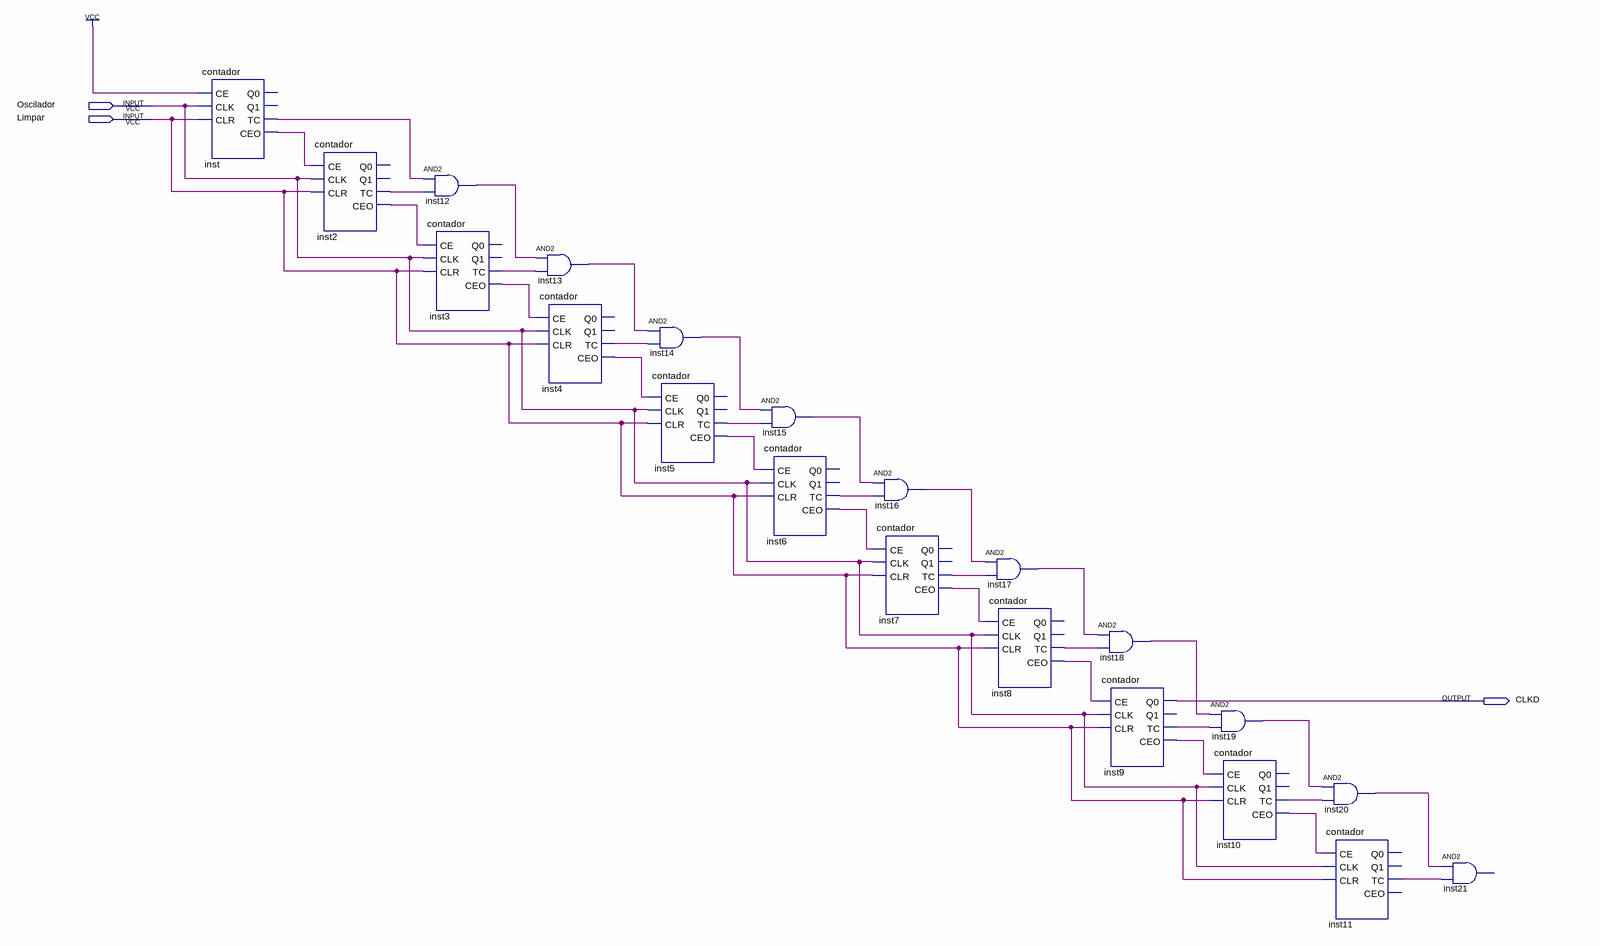
[diagram p0: schematic sheet]
// Quartus schematic divisorDeFrequencia.bdf as structural Verilog: 21 symbols, 3 pins
module divisorDeFrequencia (
  input  Oscilador,
  input  Limpar,
  output CLKD
);

  wire inst2_ceo, inst2_tc, inst3_ceo, inst3_tc, inst4_ceo, inst4_tc, inst5_ceo, inst5_tc, inst6_ceo,
       inst6_tc, inst7_ceo, inst7_tc, inst8_ceo, inst8_tc, inst9_ceo, inst9_tc, inst10_ceo, inst10_tc,
       inst11_tc, inst12_out, inst13_out, inst14_out, inst15_out, inst16_out, inst17_out, inst18_out,
       inst19_out, inst20_out, inst_ceo, inst_tc;

  contador inst (.CE(1'b1), .CLK(Oscilador), .CLR(Limpar), .TC(inst_tc), .CEO(inst_ceo));  // open: Q0, Q1
  contador inst2 (.CE(inst_ceo), .CLK(Oscilador), .CLR(Limpar), .TC(inst2_tc), .CEO(inst2_ceo));  // open: Q0, Q1
  and inst12 (inst12_out, inst_tc, inst2_tc);
  contador inst3 (.CE(inst2_ceo), .CLK(Oscilador), .CLR(Limpar), .TC(inst3_tc), .CEO(inst3_ceo));  // open: Q0, Q1
  and inst13 (inst13_out, inst12_out, inst3_tc);
  contador inst4 (.CE(inst3_ceo), .CLK(Oscilador), .CLR(Limpar), .TC(inst4_tc), .CEO(inst4_ceo));  // open: Q0, Q1
  and inst14 (inst14_out, inst13_out, inst4_tc);
  contador inst5 (.CE(inst4_ceo), .CLK(Oscilador), .CLR(Limpar), .TC(inst5_tc), .CEO(inst5_ceo));  // open: Q0, Q1
  and inst15 (inst15_out, inst14_out, inst5_tc);
  contador inst6 (.CE(inst5_ceo), .CLK(Oscilador), .CLR(Limpar), .TC(inst6_tc), .CEO(inst6_ceo));  // open: Q0, Q1
  and inst16 (inst16_out, inst15_out, inst6_tc);
  contador inst7 (.CE(inst6_ceo), .CLK(Oscilador), .CLR(Limpar), .TC(inst7_tc), .CEO(inst7_ceo));  // open: Q0, Q1
  and inst17 (inst17_out, inst16_out, inst7_tc);
  contador inst8 (.CE(inst7_ceo), .CLK(Oscilador), .CLR(Limpar), .TC(inst8_tc), .CEO(inst8_ceo));  // open: Q0, Q1
  and inst18 (inst18_out, inst17_out, inst8_tc);
  contador inst9 (
    .CE(inst8_ceo), .CLK(Oscilador), .CLR(Limpar), .Q0(CLKD), .TC(inst9_tc), .CEO(inst9_ceo));  // open: Q1
  and inst19 (inst19_out, inst18_out, inst9_tc);
  contador inst10 (.CE(inst9_ceo), .CLK(Oscilador), .CLR(Limpar), .TC(inst10_tc), .CEO(inst10_ceo));  // open: Q0, Q1
  and inst20 (inst20_out, inst19_out, inst10_tc);
  contador inst11 (.CE(inst10_ceo), .CLK(Oscilador), .CLR(Limpar), .TC(inst11_tc));  // open: Q0, Q1, CEO
  // AND2 inst21 has open pins: IN1=inst20_out, IN2=inst11_tc, OUT=open
endmodule
